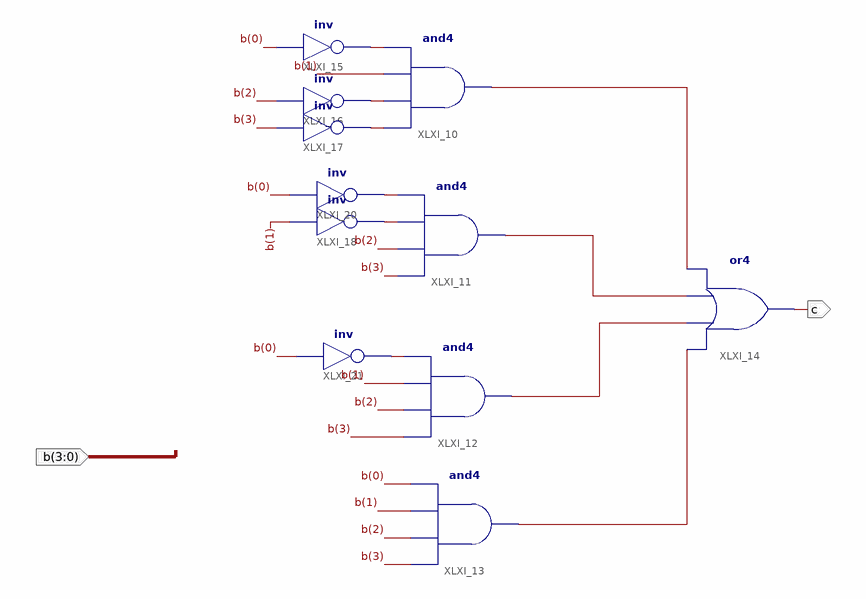
[diagram p0: schematic sheet 1]
// Xilinx ISE schematic c.sch (artix7) as structural Verilog: 11 symbols, 2 ports
module c (
  input  [3:0] b,
  output c
);

  wire XLXN_22, XLXN_23, XLXN_24, XLXN_25, XLXN_27, XLXN_28, XLXN_29, XLXN_30, XLXN_31, XLXN_32;

  and XLXI_10 (XLXN_29, XLXN_24, XLXN_23, b[1], XLXN_22);
  and XLXI_11 (XLXN_30, b[3], b[2], XLXN_25, XLXN_27);
  and XLXI_12 (XLXN_31, b[3], b[2], b[1], XLXN_28);
  and XLXI_13 (XLXN_32, b[3], b[2], b[1], b[0]);
  or XLXI_14 (c, XLXN_32, XLXN_31, XLXN_30, XLXN_29);
  not XLXI_15 (XLXN_22, b[0]);
  not XLXI_16 (XLXN_23, b[2]);
  not XLXI_17 (XLXN_24, b[3]);
  not XLXI_18 (XLXN_25, b[1]);
  not XLXI_20 (XLXN_27, b[0]);
  not XLXI_21 (XLXN_28, b[0]);
endmodule
